# EAGLE design sbb-shield (EAGLE 9.4.1)

## Sheet 1 of 3
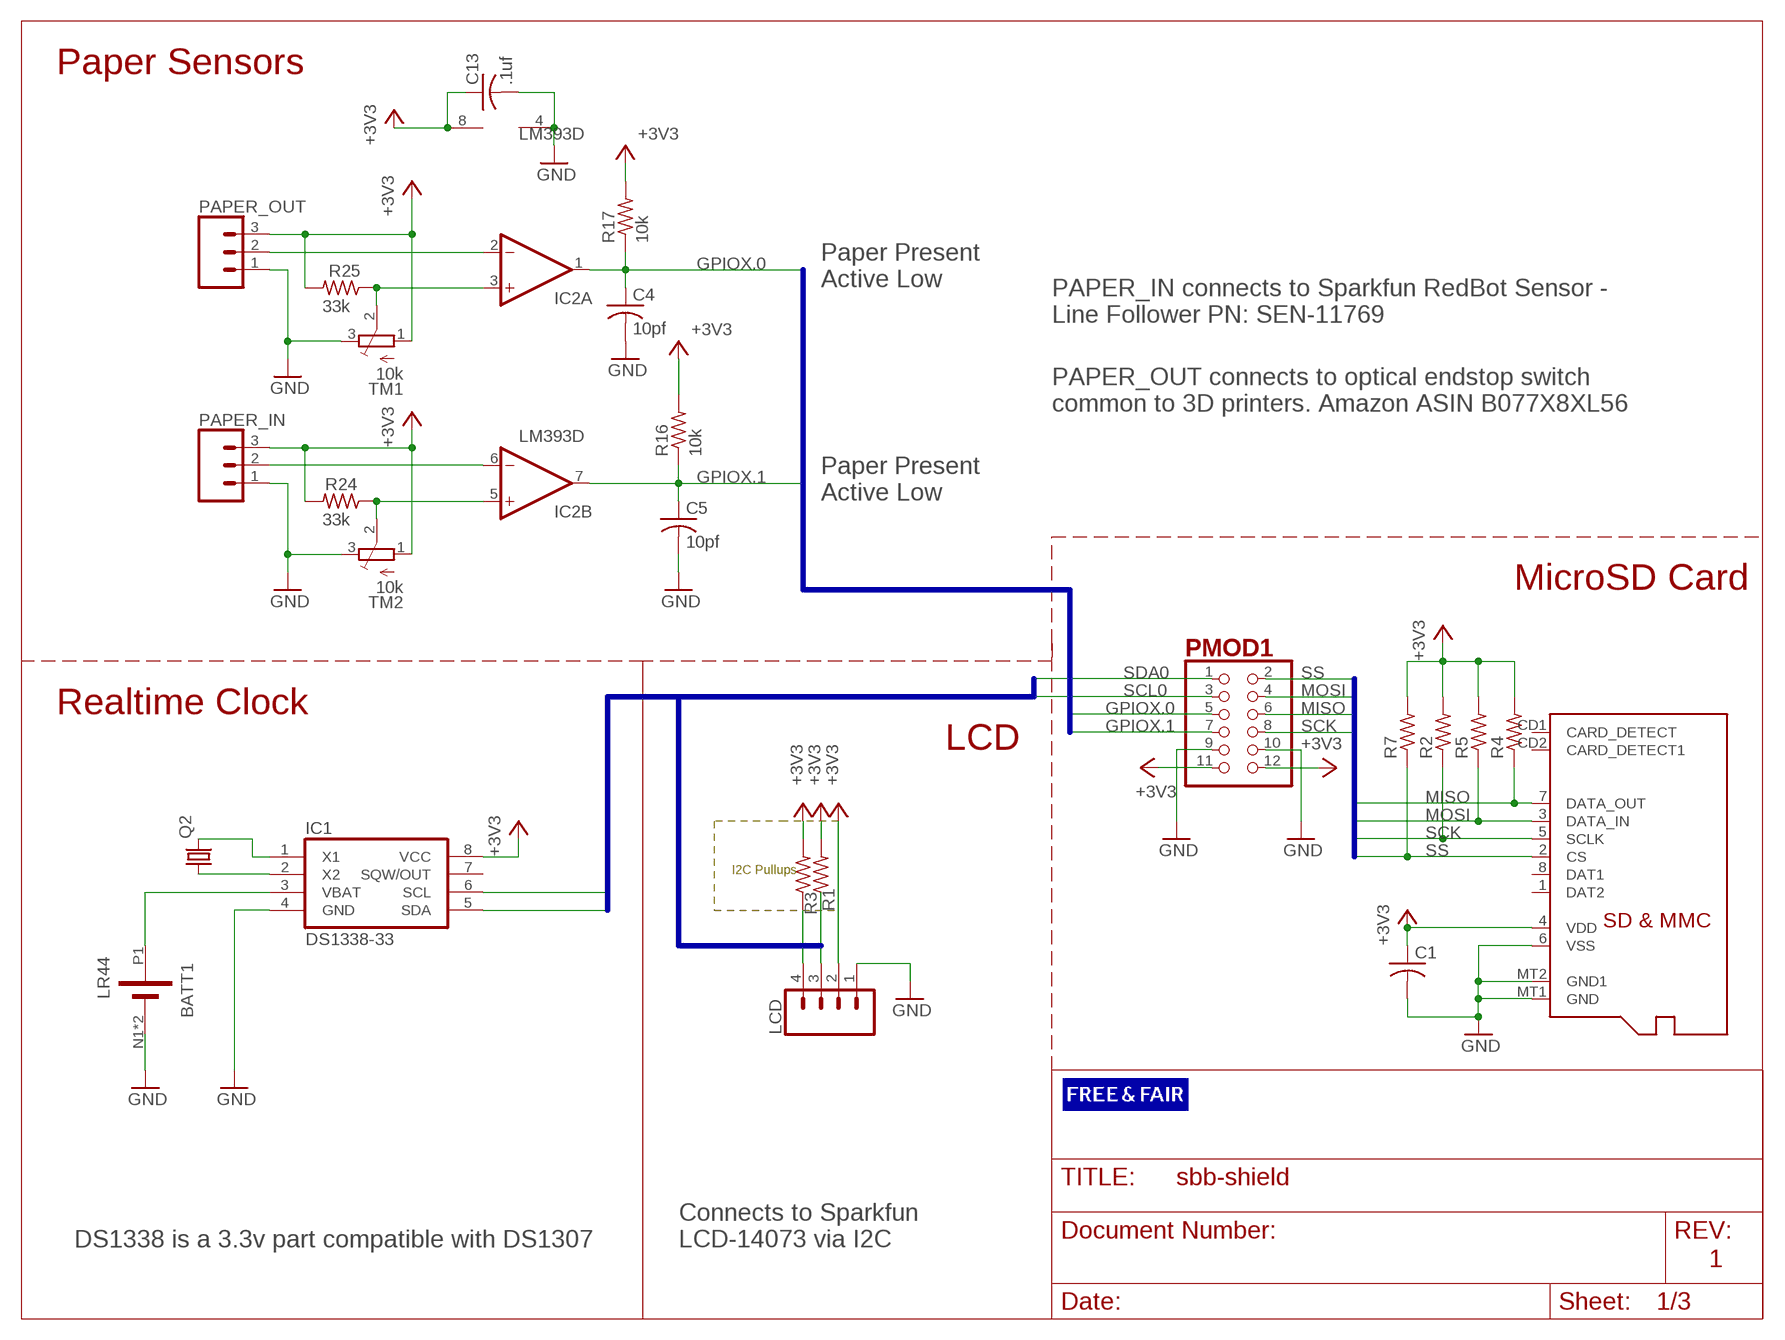
[diagram p0: schematic, sheet 1]

### Parts
BATT1  LR44  [LR44]
C1  C-USC0603K  [C0603K]
C4  10pf  C-USC0603K  [C0603K]
C5  10pf  C-USC0603K  [C0603K]
C13  .1uf  C-USC0603K  [C0603K]
IC1  DS1338-33  IC_RTC_DS1307  [SO-8]
IC2  LM393D  [SO08]
LCD  CONN_04POLAR_LOCK  [MOLEX-1X4_LOCK]
PAPER_IN  CONN_03POLAR_LOCK  [MOLEX-1X3_LOCK]
PAPER_OUT  CONN_03POLAR_LOCK  [MOLEX-1X3_LOCK]
PMOD1  PINHD-2X6  [2X06]
Q2  CRYSTALTC26H  [TC26H]
R1  R-US_R0603  [R0603]
R2  R-US_R0603  [R0603]
R3  R-US_R0603  [R0603]
R4  R-US_R0603  [R0603]
R5  R-US_R0603  [R0603]
R7  R-US_R0603  [R0603]
R16  10k  R-US_R0603  [R0603]
R17  10k  R-US_R0603  [R0603]
R24  33k  R-US_R0603  [R0603]
R25  33k  R-US_R0603  [R0603]
TM1  10k  TRIMPOTTC33X  [TC33X]
TM2  10k  TRIMPOTTC33X  [TC33X]
U1  MICROSD  [MICROSD]

### Nets
+3V3: C1.1 C13.1 IC1.8(VCC) IC2.8(P:V+) LCD.2 PAPER_IN.3 PAPER_OUT.3 PMOD1.11 PMOD1.12 R1.2 R2.2 R3.2 R4.2 R5.2 R7.2 R16.2 R17.2 R24.2 R25.2 TM1.1(A) TM2.1(A) U1.4(VDD) ; also sheet 2,3
GND: BATT1.N1(NEG) BATT1.N2(NEG) C1.2 C4.2 C5.2 C13.2 IC1.4(GND) IC2.4(P:V-) LCD.1 PAPER_IN.1 PAPER_OUT.1 PMOD1.9 PMOD1.10 TM1.3(E) TM2.3(E) U1.6(VSS) U1.MT1(GND) U1.MT2(GND1) ; also sheet 2,3
GPIOX.0: C4.1 IC2.1(A:OUT) PMOD1.5 R17.1 ; also sheet 3
GPIOX.1: C5.1 IC2.7(B:OUT) PMOD1.7 R16.1 ; also sheet 3
MISO: PMOD1.6 R4.1 U1.7(DATA_OUT) ; also sheet 3
MOSI: PMOD1.4 R5.1 U1.3(DATA_IN) ; also sheet 3
N$1: IC2.5(B:+IN) R24.1 TM2.2(S)
N$2: IC2.3(A:+IN) R25.1 TM1.2(S)
N$3: IC1.1(X1) Q2.2
N$8: IC1.2(X2) Q2.1
N$9: BATT1.P1(POS) IC1.3(VBAT)
N$13: IC2.2(A:-IN) PAPER_OUT.2
N$15: IC2.6(B:-IN) PAPER_IN.2
SCK: PMOD1.8 R2.1 U1.5(SCLK) ; also sheet 3
SCL0: IC1.6(SCL) LCD.4 PMOD1.3 R3.1 ; also sheet 3
SDA0: IC1.5(SDA) LCD.3 PMOD1.1 R1.1 ; also sheet 3
SS: PMOD1.2 R7.1 U1.2(CS) ; also sheet 3
Unconnected: IC1.7(SQW/OUT) U1.1(DAT2) U1.8(DAT1) U1.CD1(CARD_DETECT) U1.CD2(CARD_DETECT1)

### Buses
MISO,MOSI,SCK,SS
I2C:SCL0,SDA0
GPIOX.0,GPIOX.1

### Notes on the sheet
- Paper Sensors
- Paper Present
  Active Low
- PAPER_IN connects to Sparkfun RedBot Sensor - 
  Line Follower PN: SEN-11769
- PAPER_OUT connects to optical endstop switch 
  common to 3D printers. Amazon ASIN B077X8XL56
- Paper Present
  Active Low
- MicroSD Card
- Realtime Clock
- LCD
- I2C Pullups
- DS1338 is a 3.3v part compatible with DS1307
- Connects to Sparkfun
  LCD-14073 via I2C
- 1

## Sheet 2 of 3
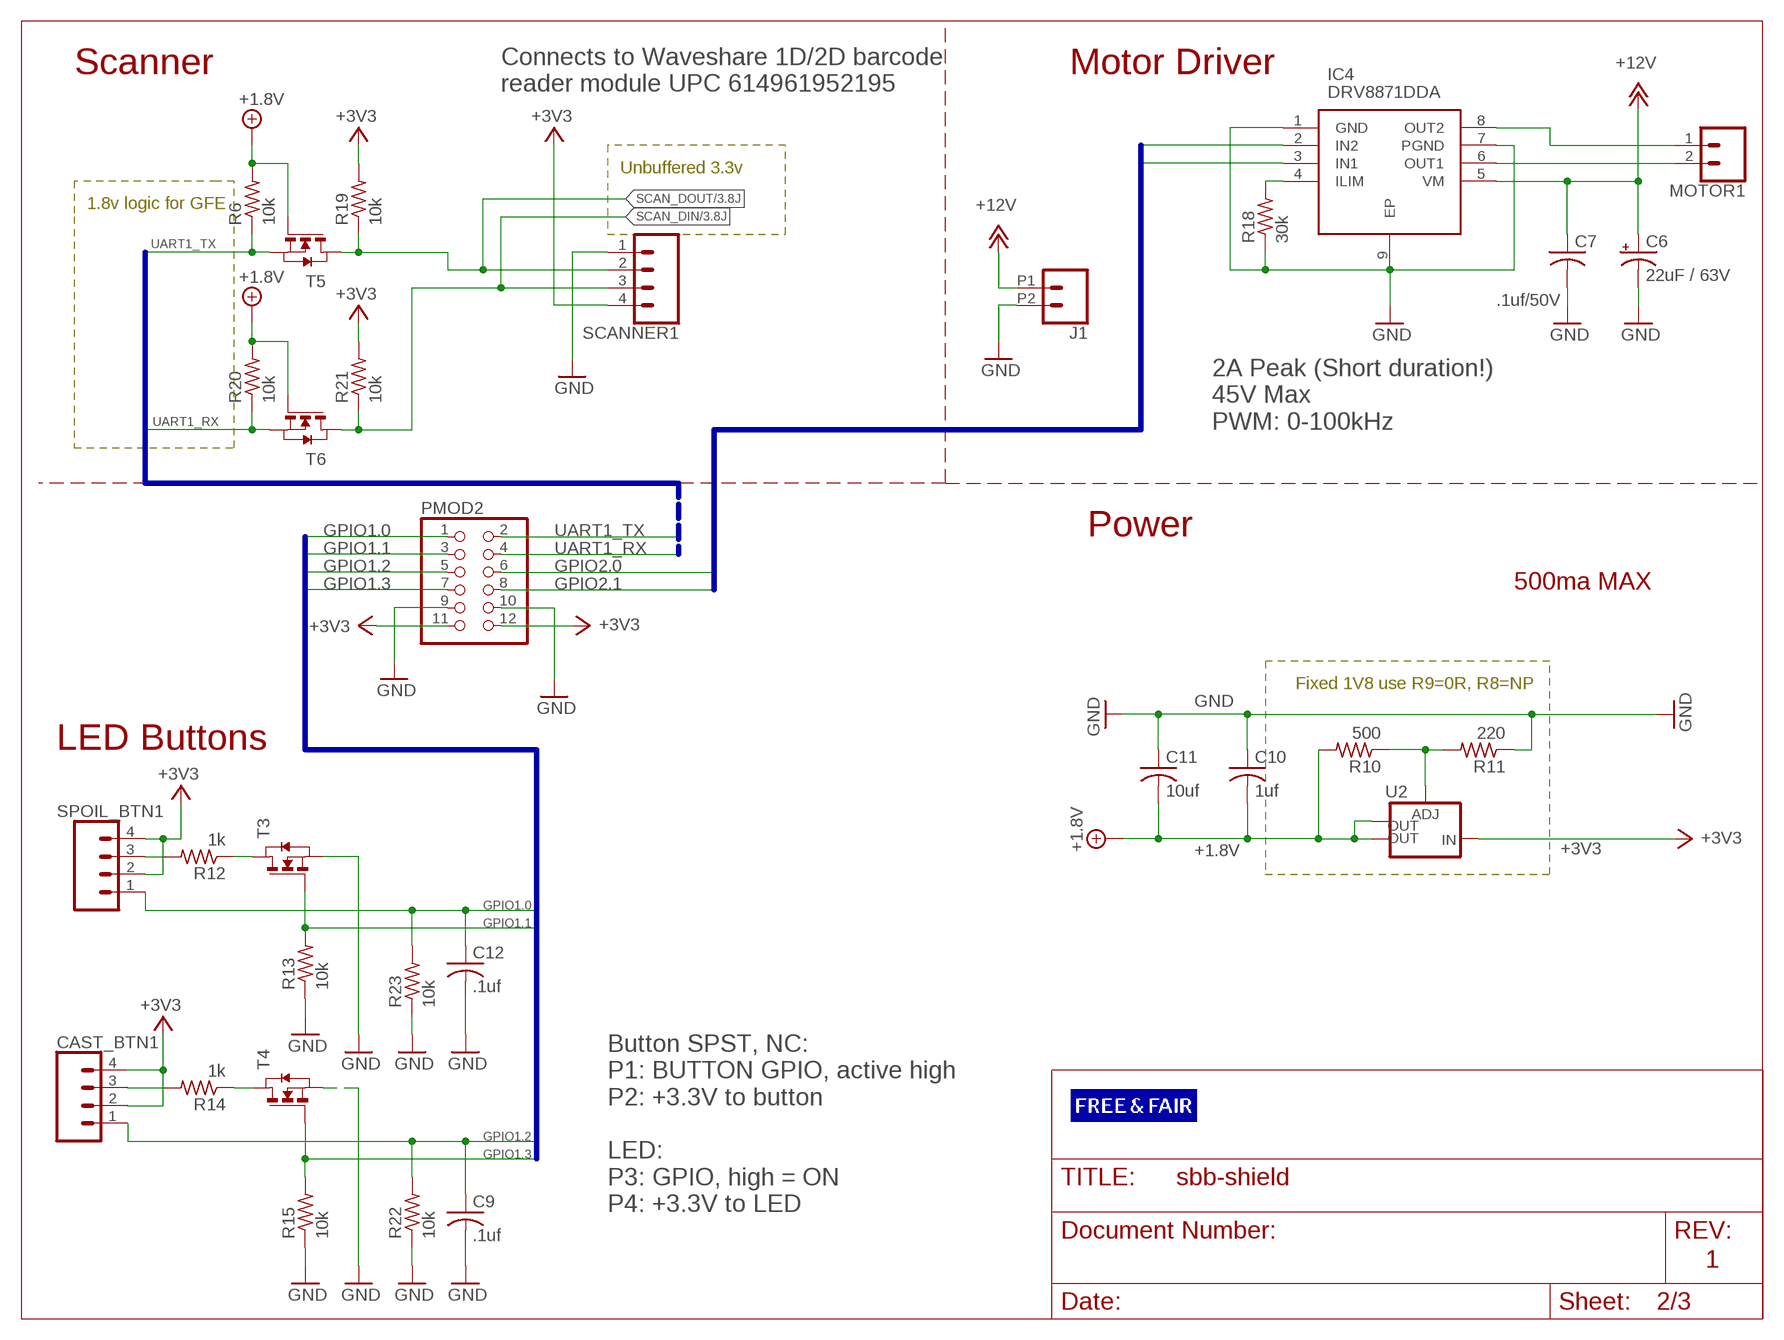
[diagram p1: schematic, sheet 2]

### Parts
C6  22uF / 63V  CPOL-USD  [PANASONIC_D]
C7  .1uf/50V  C-USC0805K  [C0805K]
C9  .1uf  C-USC0603K  [C0603K]
C10  1uf  C-USC0603K  [C0603K]
C11  10uf  C-USC1206K  [C1206K]
C12  .1uf  C-USC0603K  [C0603K]
CAST_BTN1  CONN_04POLAR_LOCK  [MOLEX-1X4_LOCK]
IC4  DRV8871DDA  [SOIC127P600X170-9N]
J1  CONN_022.54MM_SCREWTERM  [1X02_2.54_SCREWTERM]
MOTOR1  CONN_02POLAR_LOCK  [MOLEX-1X2_LOCK]
PMOD2  PINHD-2X6  [2X06]
R6  10k  R-US_R0603  [R0603]
R10  500  R-US_R0603  [R0603]
R11  220  R-US_R0603  [R0603]
R12  1k  R-US_R0603  [R0603]
R13  10k  R-US_R0603  [R0603]
R14  1k  R-US_R0603  [R0603]
R15  10k  R-US_R0603  [R0603]
R18  30k  R-US_R0603  [R0603]
R19  10k  R-US_R0603  [R0603]
R20  10k  R-US_R0603  [R0603]
R21  10k  R-US_R0603  [R0603]
R22  10k  R-US_R0603  [R0603]
R23  10k  R-US_R0603  [R0603]
SCANNER1  CONN_04POLAR_LOCK  [MOLEX-1X4_LOCK]
SPOIL_BTN1  CONN_04POLAR_LOCK  [MOLEX-1X4_LOCK]
T3  NMOSSOT23  [SOT-23]
T4  NMOSSOT23  [SOT-23]
T5  NMOSSOT23  [SOT-23]
T6  NMOSSOT23  [SOT-23]
U2  V_REG_LM1117SOT223  [SOT223]

### Nets
+1.8V: C10.2 C11.2 R6.2 R10.2 R20.2 T5.3(G) T6.3(G) U2.2(OUT) U2.4(OUT)
+3V3: CAST_BTN1.2 CAST_BTN1.4 PMOD2.11 PMOD2.12 R19.2 R21.2 SCANNER1.4 SPOIL_BTN1.2 SPOIL_BTN1.4 U2.3(IN) ; also sheet 1,3
+12V: C6.+ C7.1 IC4.5(VM) J1.P1
GND: C6.- C7.2 C9.2 C10.1 C11.1 C12.2 IC4.1(GND) IC4.7(PGND) IC4.9(EP) J1.P2 PMOD2.9 PMOD2.10 R11.1 R13.1 R15.1 R18.1 R22.1 R23.1 SCANNER1.1 T3.2(S) T4.2(S) ; also sheet 1,3
GPIO1.0: C12.1 PMOD2.1 R23.2 SPOIL_BTN1.1 ; also sheet 3
GPIO1.1: PMOD2.3 R13.2 T3.3(G) ; also sheet 3
GPIO1.2: C9.1 CAST_BTN1.1 PMOD2.5 R22.2 ; also sheet 3
GPIO1.3: PMOD2.7 R15.2 T4.3(G) ; also sheet 3
GPIO2.0: IC4.2(IN2) PMOD2.6 ; also sheet 3
GPIO2.1: IC4.3(IN1) PMOD2.8 ; also sheet 3
N$10: R12.1 T3.1(D)
N$12: R10.1 R11.2 U2.1(ADJ)
N$14: R12.2 SPOIL_BTN1.3
N$22: IC4.8(OUT2) MOTOR1.1
N$26: R14.1 T4.1(D)
N$28: IC4.6(OUT1) MOTOR1.2
N$29: IC4.4(ILIM) R18.2
N$30: CAST_BTN1.3 R14.2
SCAN_DIN: R21.1 SCANNER1.3 T6.1(D) ; also sheet 3
SCAN_DOUT: R19.1 SCANNER1.2 T5.1(D) ; also sheet 3
UART1_RX: PMOD2.4 R20.1 T6.2(S)
UART1_TX: PMOD2.2 R6.1 T5.2(S)

### Buses
UART1_RX,UART1_TX
GPIO2.0,GPIO2.1
GPIO1.0,UART1_TX,GND,GPIO2.0,UART1_RX,GPIO2.1,GPIO1.1,GPIO1.2,GPIO1.3

### Notes on the sheet
- Scanner | Motor Driver
- Connects to Waveshare 1D/2D barcode
  reader module UPC 614961952195
- Unbuffered 3.3v
- 1.8v logic for GFE
- 2A Peak (Short duration!)
  45V Max
  PWM: 0-100kHz
- Power
- 500ma MAX
- Fixed 1V8 use R9=0R, R8=NP
- LED Buttons
- Button SPST, NC:
  P1: BUTTON GPIO, active high
  P2: +3.3V to button 
  
  LED:
  P3: GPIO, high = ON
  P4: +3.3V to LED
- 1

## Sheet 3 of 3
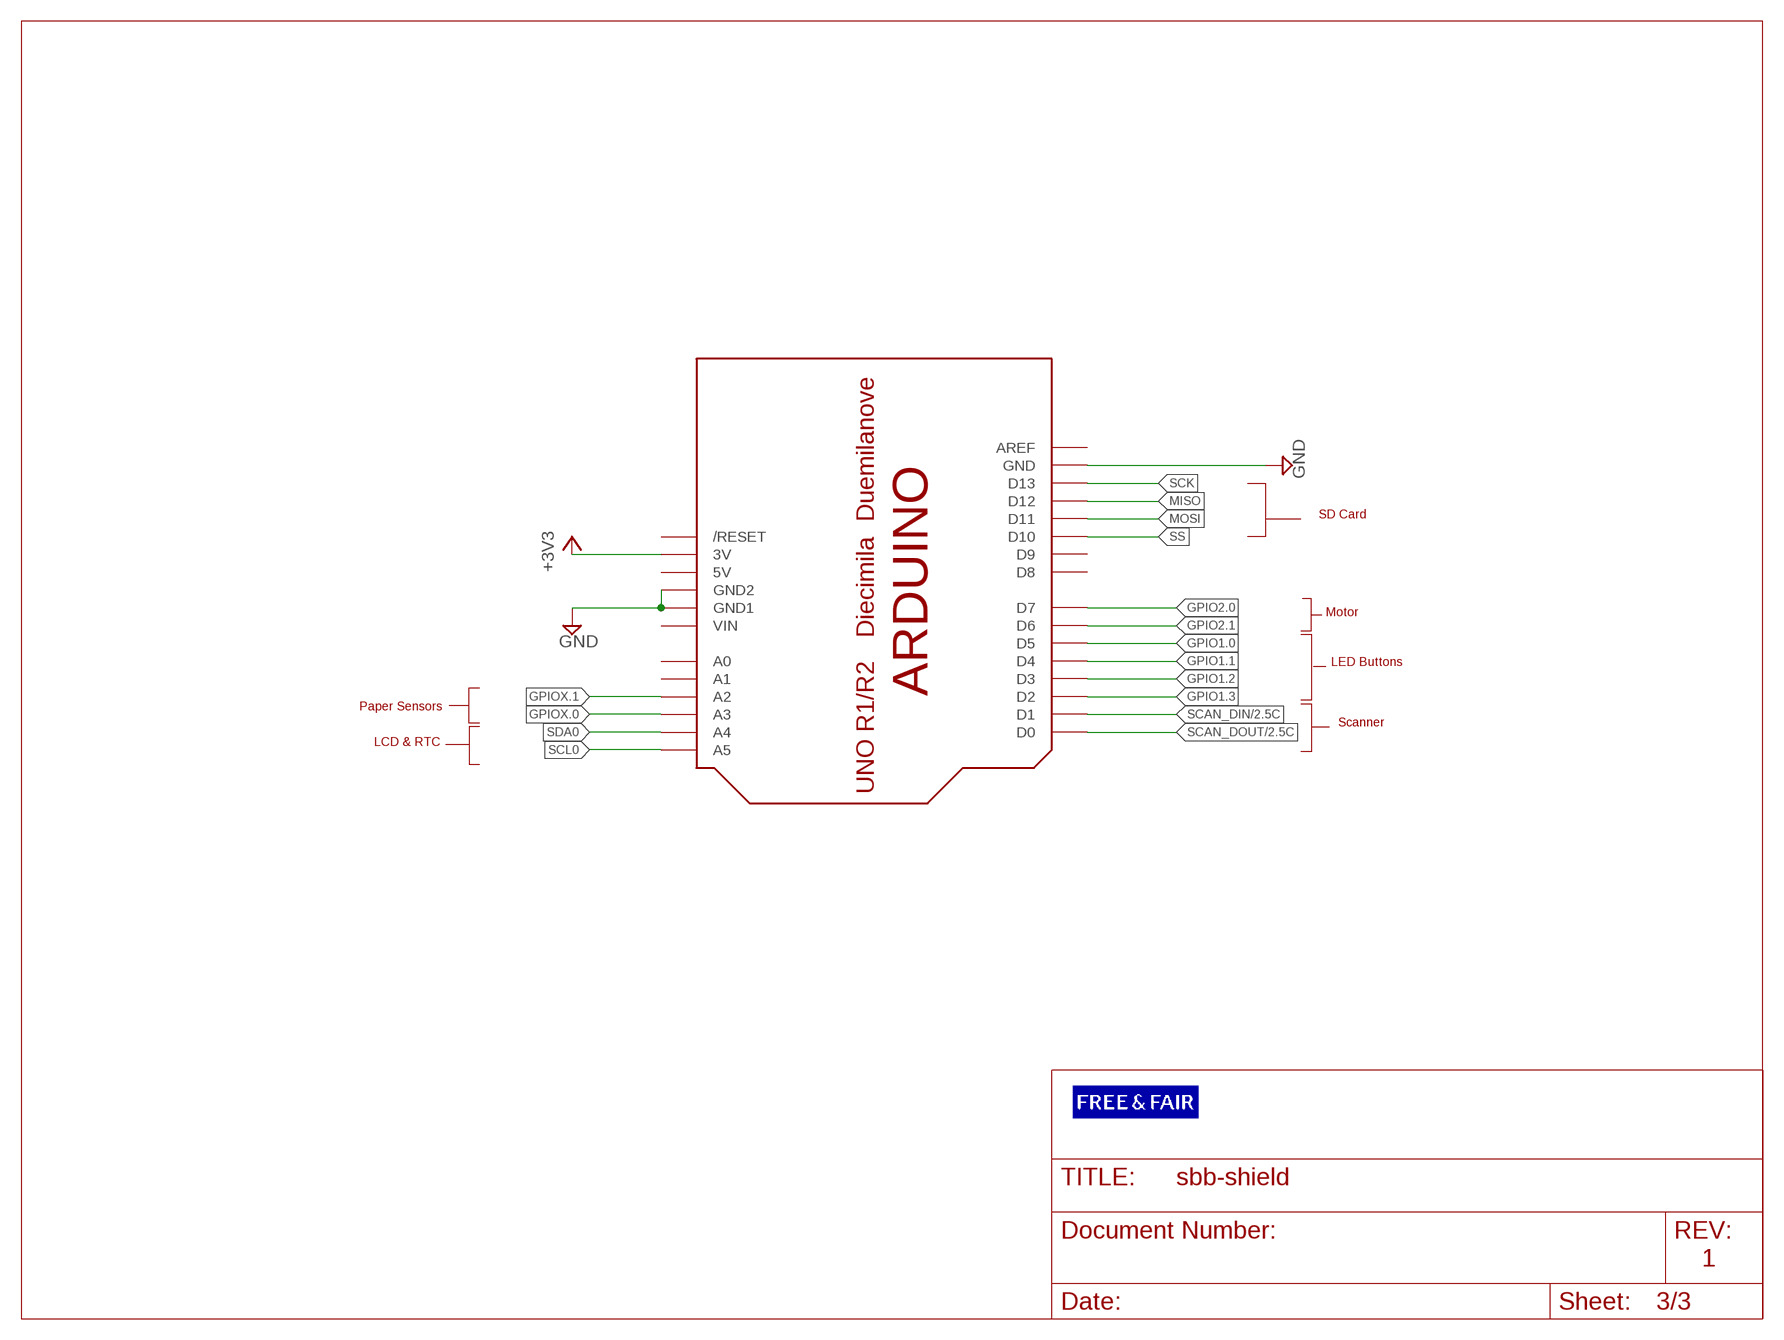
[diagram p2: schematic, sheet 3]

### Parts
U$2  ARDUINO-NOHOLE  [ARDUINO-NOHOLE]

### Nets
+3V3: U$2.3V ; also sheet 1,2
GND: U$2.GND U$2.GND1 U$2.GND2 ; also sheet 1,2
GPIO1.0: U$2.D5 ; also sheet 2
GPIO1.1: U$2.D4 ; also sheet 2
GPIO1.2: U$2.D3 ; also sheet 2
GPIO1.3: U$2.D2 ; also sheet 2
GPIO2.0: U$2.D7 ; also sheet 2
GPIO2.1: U$2.D6 ; also sheet 2
GPIOX.0: U$2.A3 ; also sheet 1
GPIOX.1: U$2.A2 ; also sheet 1
MISO: U$2.D12 ; also sheet 1
MOSI: U$2.D11 ; also sheet 1
SCAN_DIN: U$2.D1 ; also sheet 2
SCAN_DOUT: U$2.D0 ; also sheet 2
SCK: U$2.D13 ; also sheet 1
SCL0: U$2.A5 ; also sheet 1
SDA0: U$2.A4 ; also sheet 1
SS: U$2.D10 ; also sheet 1
Unconnected: U$2.A0 U$2.A1 U$2.AREF U$2.D8 U$2.D9 U$2.RESET(/RESET)

### Notes on the sheet
- SD Card
- Motor
- LED Buttons
- Paper Sensors
- Scanner
- LCD & RTC
- 1

## Power pins joined to a net without a drawn wire
5V: U$2.5V
VIN: U$2.VIN

## Library data of the parts
BATT1 = bitsetters:LR44
C1 C4 C5 C7 C13 = adafruit:C-US: CAPACITOR, American symbol
C6 = adafruit:CPOL-US: POLARIZED CAPACITOR, American symbol
C9 C10 C12 = rcl:C-US: CAPACITOR, American symbol; SPICEPREFIX: C
C11 = resistor:C-US: CAPACITOR, American symbol
CAST_BTN1 LCD SCANNER1 SPOIL_BTN1 = SparkFun-Connectors:CONN_04: Multi connection point. Often used as Generic Header-pin footprint for 0.1 inch spaced/style header connections On any of the 0.1 inch spaced packages, you can populate with these: Break Away Headers - Straight <https://www.sparkfun.com/products/116> (PRT-00116) Break Away Male Headers - Right Angle <https://www.sparkfun.com/products/553> (PRT-00553) Female Headers <https://www.sparkfun.com/products/115> (PRT-00115) Break Away Headers - Machine Pin <https://www.sparkfun.com/products/117> (PRT-00117) Break Away Female Headers - Swiss Machine Pin <https://www.sparkfun.com/products/743> (PRT-00743) For SCREWTERMINALS and SPRING TERMINALS visit here: Screw Terimnals on SparkFun.com <https://www.sparkfun.com/search/results?term=Screw+Terminals> (5mm/3.5mm/2.54mm spacing) This device is also useful as a general connection point to wire up your design to another part of your project. Our various solder wires solder well into these plated through hole pads. Hook-Up Wire - Assortment (Stranded, 22 AWG) <https://www.sparkfun.com/products/11375> (PRT-11375) Hook-Up Wire - Assortment (Solid Core, 22 AWG) <https://www.sparkfun.com/products/11367> (PRT-11367) View the entire wire category on our website here <https://www.sparkfun.com/categories/141> Special notes: Molex polarized connector foot print use with SKU : PRT-08231 with associated crimp pins and housings. 1MM SMD Version SKU: PRT-10208; PROD_ID: CONN-08186; SF_ID: PRT-08231
IC1 = dp_devices:IC_RTC_DS1307
IC2 = linear:LM393: COMPARATOR
IC4 = SamacSys_Parts:DRV8871DDA: Motor / Motion / Ignition Controllers & Drivers 3.6A Brushed DC Motor Driver with Integrated Current Sensing (PWM Ctrl) 8-SO PowerPAD -40 to 125 Source: Datasheet <http://www.ti.com/lit/ds/symlink/drv8871.pdf>; DESCRIPTION: Motor / Motion / Ignition Controllers & Drivers 3.6A Brushed DC Motor Driver with Integrated Current Sensing (PWM Ctrl) 8-SO PowerPAD -40 to 125; HEIGHT: 1.7mm; MANUFACTURER_NAME: Texas Instruments; MANUFACTURER_PART_NUMBER: DRV8871DDA; MOUSER_PART_NUMBER: 595-DRV8871DDA; MOUSER_PRICE-STOCK: https://www.mouser.com/Search/Refine.aspx?Keyword=595-DRV8871DDA
J1 = SparkFun-Connectors:CONN_02: Multi connection point. Often used as Generic Header-pin footprint for 0.1 inch spaced/style header connections On any of the 0.1 inch spaced packages, you can populate with these: Break Away Headers - Straight <https://www.sparkfun.com/products/116> (PRT-00116) Break Away Male Headers - Right Angle <https://www.sparkfun.com/products/553> (PRT-00553) Female Headers <https://www.sparkfun.com/products/115> (PRT-00115) Break Away Headers - Machine Pin <https://www.sparkfun.com/products/117> (PRT-00117) Break Away Female Headers - Swiss Machine Pin <https://www.sparkfun.com/products/743> (PRT-00743) For SCREWTERMINALS and SPRING TERMINALS visit here: Screw Terimnals on SparkFun.com <https://www.sparkfun.com/search/results?term=Screw+Terminals> (5mm/3.5mm/2.54mm spacing) This device is also useful as a general connection point to wire up your design to another part of your project. Our various solder wires solder well into these plated through hole pads. Hook-Up Wire - Assortment (Stranded, 22 AWG) <https://www.sparkfun.com/products/11375> (PRT-11375) Hook-Up Wire - Assortment (Solid Core, 22 AWG) <https://www.sparkfun.com/products/11367> (PRT-11367) View the entire wire category on our website here <https://www.sparkfun.com/categories/141> Special notes: Molex polarized connector foot print use with: PRT-08233 with associated crimp pins and housings. 2.54_SCREWTERM for use with PRT-10571. 3.5mm Screw Terminal footprints for PRT-08084 5mm Screw Terminal footprints for use with PRT-08432
MOTOR1 = SparkFun-Connectors:CONN_02: Multi connection point. Often used as Generic Header-pin footprint for 0.1 inch spaced/style header connections On any of the 0.1 inch spaced packages, you can populate with these: Break Away Headers - Straight <https://www.sparkfun.com/products/116> (PRT-00116) Break Away Male Headers - Right Angle <https://www.sparkfun.com/products/553> (PRT-00553) Female Headers <https://www.sparkfun.com/products/115> (PRT-00115) Break Away Headers - Machine Pin <https://www.sparkfun.com/products/117> (PRT-00117) Break Away Female Headers - Swiss Machine Pin <https://www.sparkfun.com/products/743> (PRT-00743) For SCREWTERMINALS and SPRING TERMINALS visit here: Screw Terimnals on SparkFun.com <https://www.sparkfun.com/search/results?term=Screw+Terminals> (5mm/3.5mm/2.54mm spacing) This device is also useful as a general connection point to wire up your design to another part of your project. Our various solder wires solder well into these plated through hole pads. Hook-Up Wire - Assortment (Stranded, 22 AWG) <https://www.sparkfun.com/products/11375> (PRT-11375) Hook-Up Wire - Assortment (Solid Core, 22 AWG) <https://www.sparkfun.com/products/11367> (PRT-11367) View the entire wire category on our website here <https://www.sparkfun.com/categories/141> Special notes: Molex polarized connector foot print use with: PRT-08233 with associated crimp pins and housings. 2.54_SCREWTERM for use with PRT-10571. 3.5mm Screw Terminal footprints for PRT-08084 5mm Screw Terminal footprints for use with PRT-08432; SF_ID: PRT-09918
PAPER_IN PAPER_OUT = SparkFun-Connectors:CONN_03: Multi connection point. Often used as Generic Header-pin footprint for 0.1 inch spaced/style header connections On any of the 0.1 inch spaced packages, you can populate with these: Break Away Headers - Straight <https://www.sparkfun.com/products/116> (PRT-00116) Break Away Male Headers - Right Angle <https://www.sparkfun.com/products/553> (PRT-00553) Female Headers <https://www.sparkfun.com/products/115> (PRT-00115) Break Away Headers - Machine Pin <https://www.sparkfun.com/products/117> (PRT-00117) Break Away Female Headers - Swiss Machine Pin <https://www.sparkfun.com/products/743> (PRT-00743) Stackable Header - 3 Pin (Female, 0.1") <https://www.sparkfun.com/products/13875> (PRT-13875) For SCREWTERMINALS and SPRING TERMINALS visit here: Screw Terimnals on SparkFun.com <https://www.sparkfun.com/search/results?term=Screw+Terminals> (5mm/3.5mm/2.54mm spacing) This device is also useful as a general connection point to wire up your design to another part of your project. Our various solder wires solder well into these plated through hole pads. Hook-Up Wire - Assortment (Stranded, 22 AWG) <https://www.sparkfun.com/products/11375> (PRT-11375) Hook-Up Wire - Assortment (Solid Core, 22 AWG) <https://www.sparkfun.com/products/11367> (PRT-11367) View the entire wire category on our website here <https://www.sparkfun.com/categories/141> Special notes: Molex polarized connector foot print use with SKU : PRT-08232 with associated crimp pins and housings.; PROD_ID: CONN-08625; SF_ID: PRT-08096
PMOD1 PMOD2 = pinhead:PINHD-2X6: PIN HEADER
Q2 = adafruit (DESKTOP-MKQ6VR9's conflicted copy 2019-02-08):CRYSTAL: CRYSTAL; OC_FARNELL: unknown; OC_NEWARK: unknown
R1-R7 R12-R25 = adafruit:R-US_: RESISTOR, American symbol
R10 R11 = resistor:R-US_: RESISTOR, American symbol
T3-T6 = zetex:NMOSSOT23: MOS FET; OC_FARNELL: unknown; OC_NEWARK: unknown
TM1 TM2 = adafruit:TRIMPOT: SMT trimmer potentiometer part number TC33X http://www.ladyada.net/library/eagle
U1 = adafruit:MICROSD: Micro-SD / Transflash card holder with SPI pinout For the 3M # 2908-05WB-MG and/or 4UCON #19656 push-push type
U2 = SparkFun-IC-Power:V_REG_LM1117: Voltage Regulator LM1117 Standard adjustable voltage regulator but in SMD form. Spark Fun Electronics SKU : COM-00595; PROD_ID: VREG-08170
U$2 = adafruit:ARDUINO: Arduino Diecimila/Duemilanove Make a shield with ease, this package has all the named pins as well as the two mounting drill holes and an outline of the USB and DC power connector. The outline is on the DIMENSION layer, so if your board house uses it they will cut the outline to match. http://www.ladyada.net/library/pcb/eaglelibrary.html

## Board
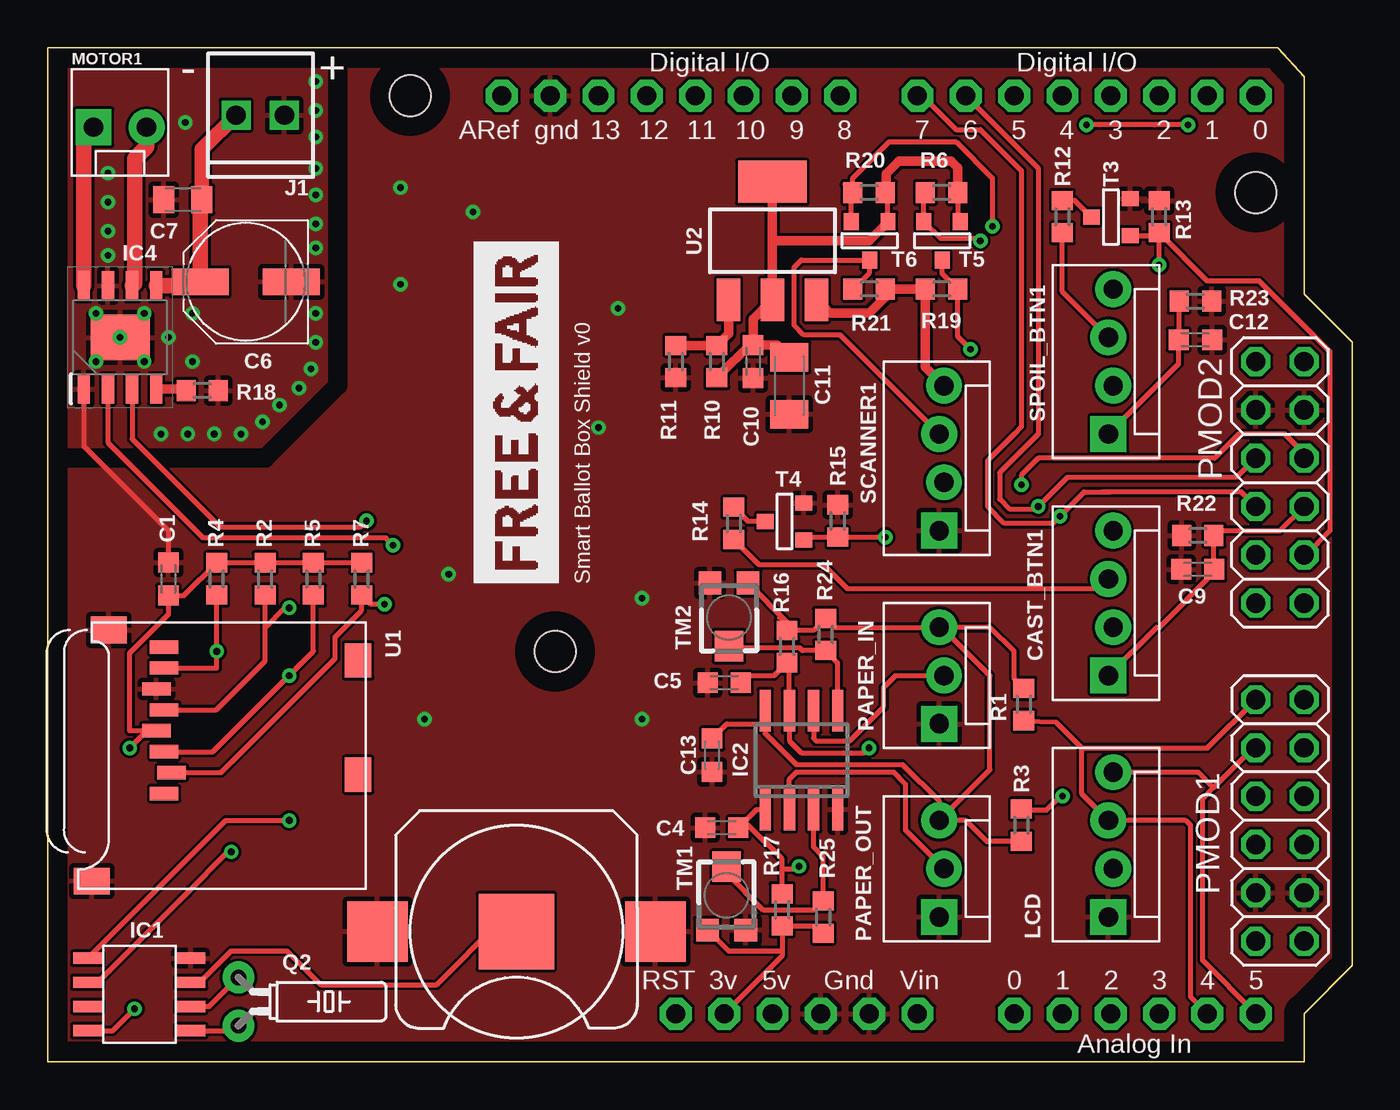
[diagram p3: board, top side]
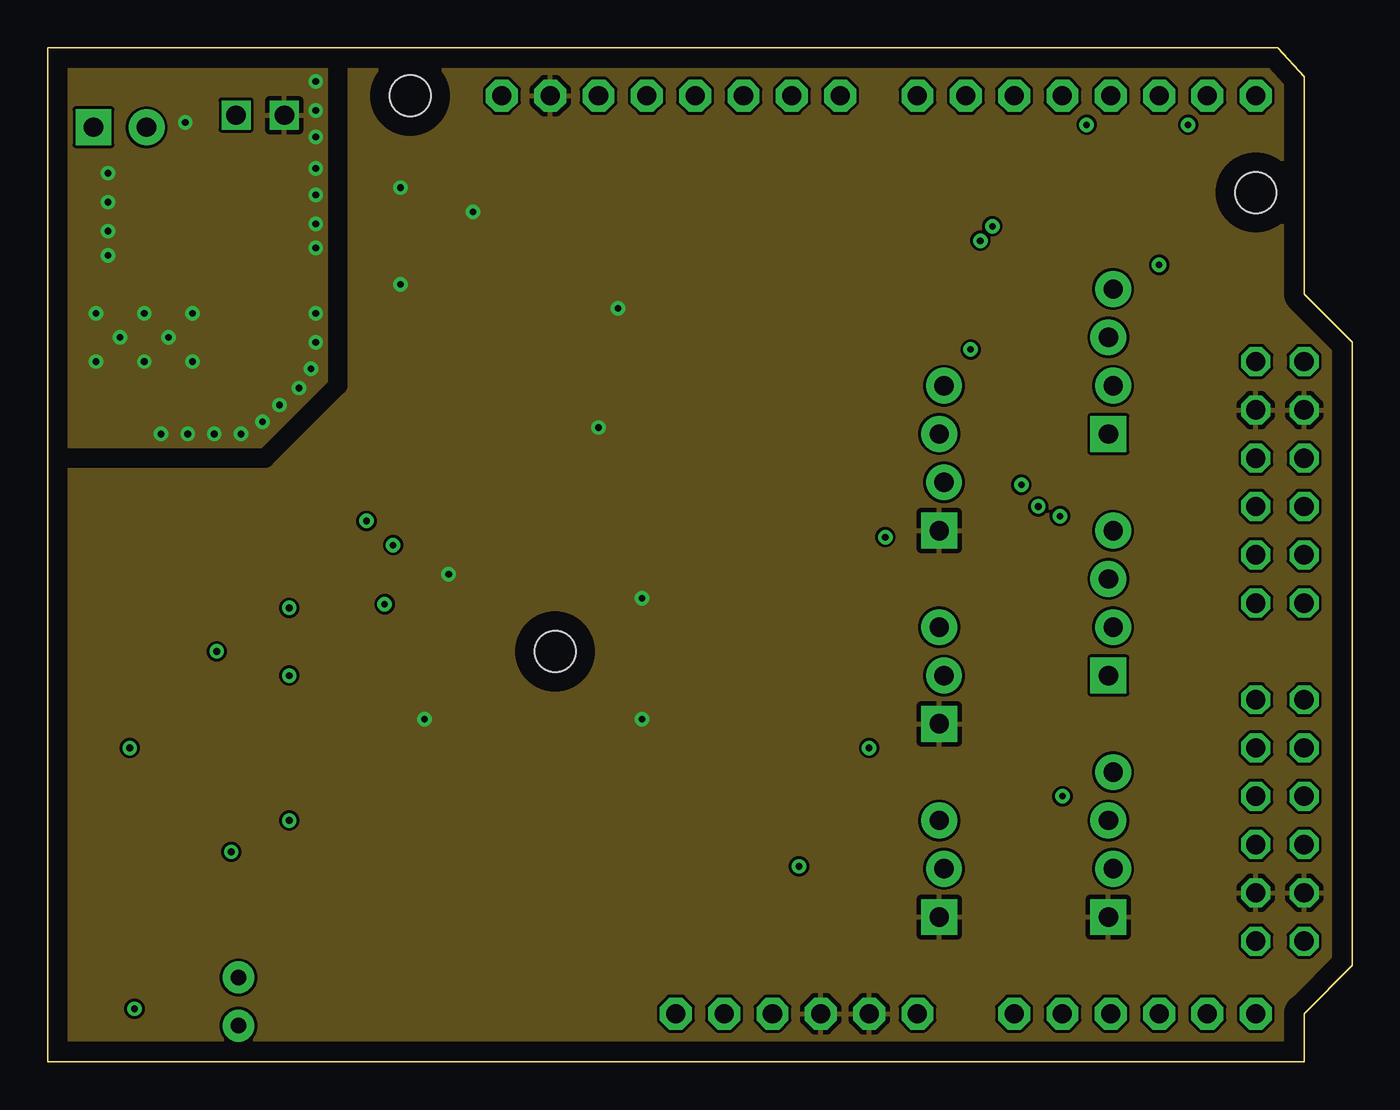
[diagram p4: board, inner layer Route2]
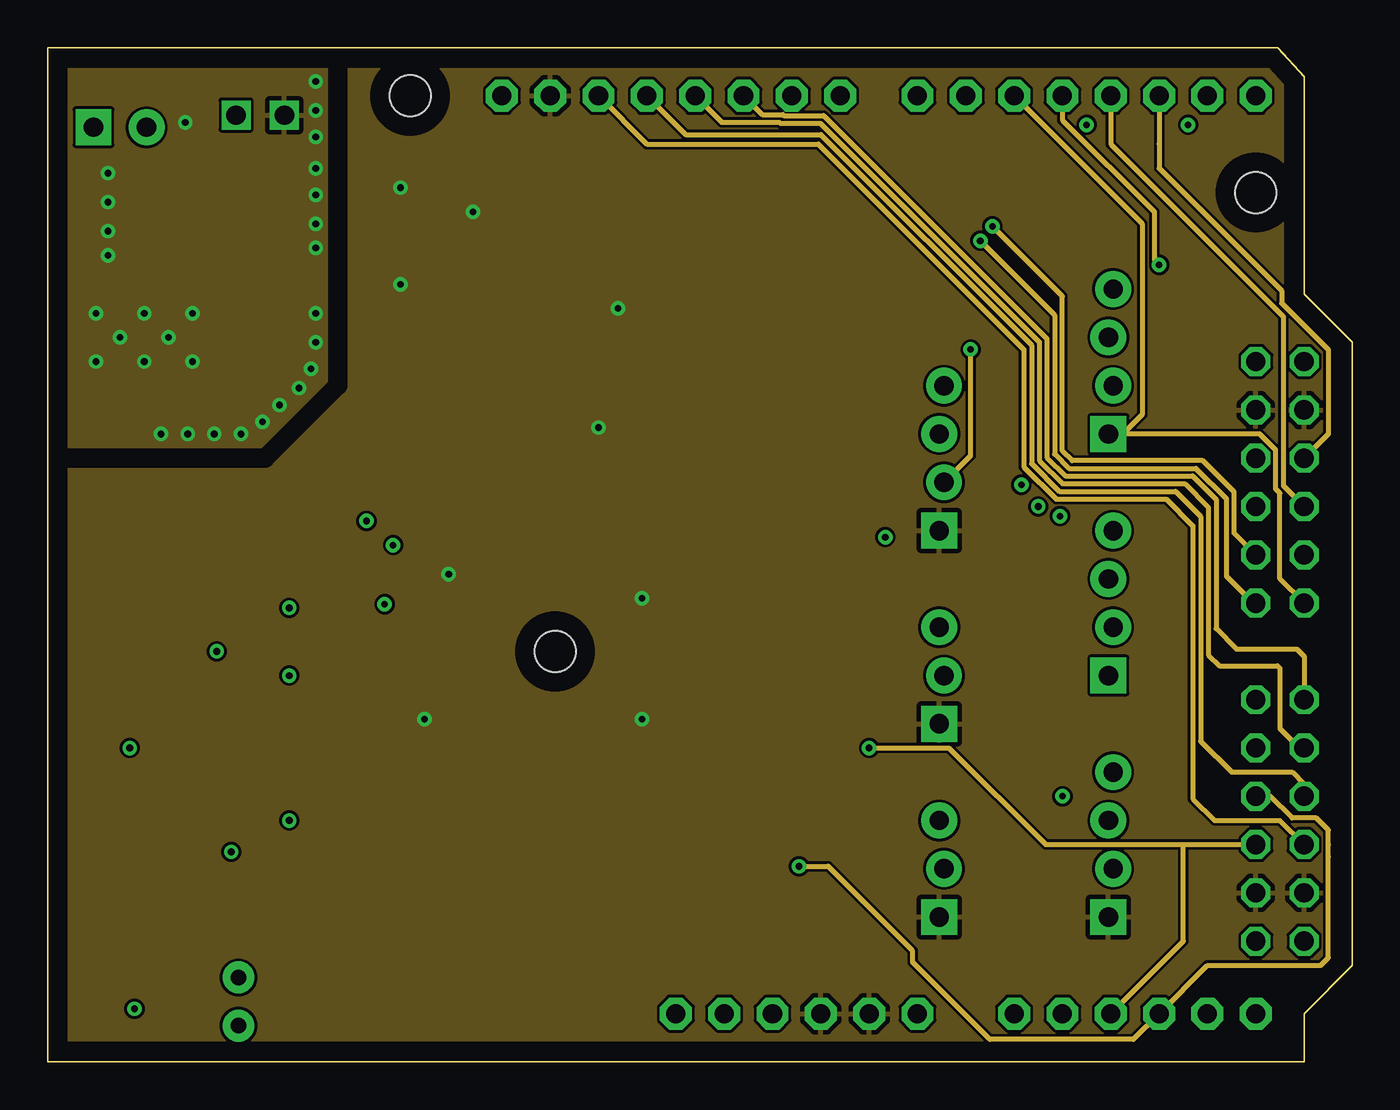
[diagram p5: board, inner layer Route15]
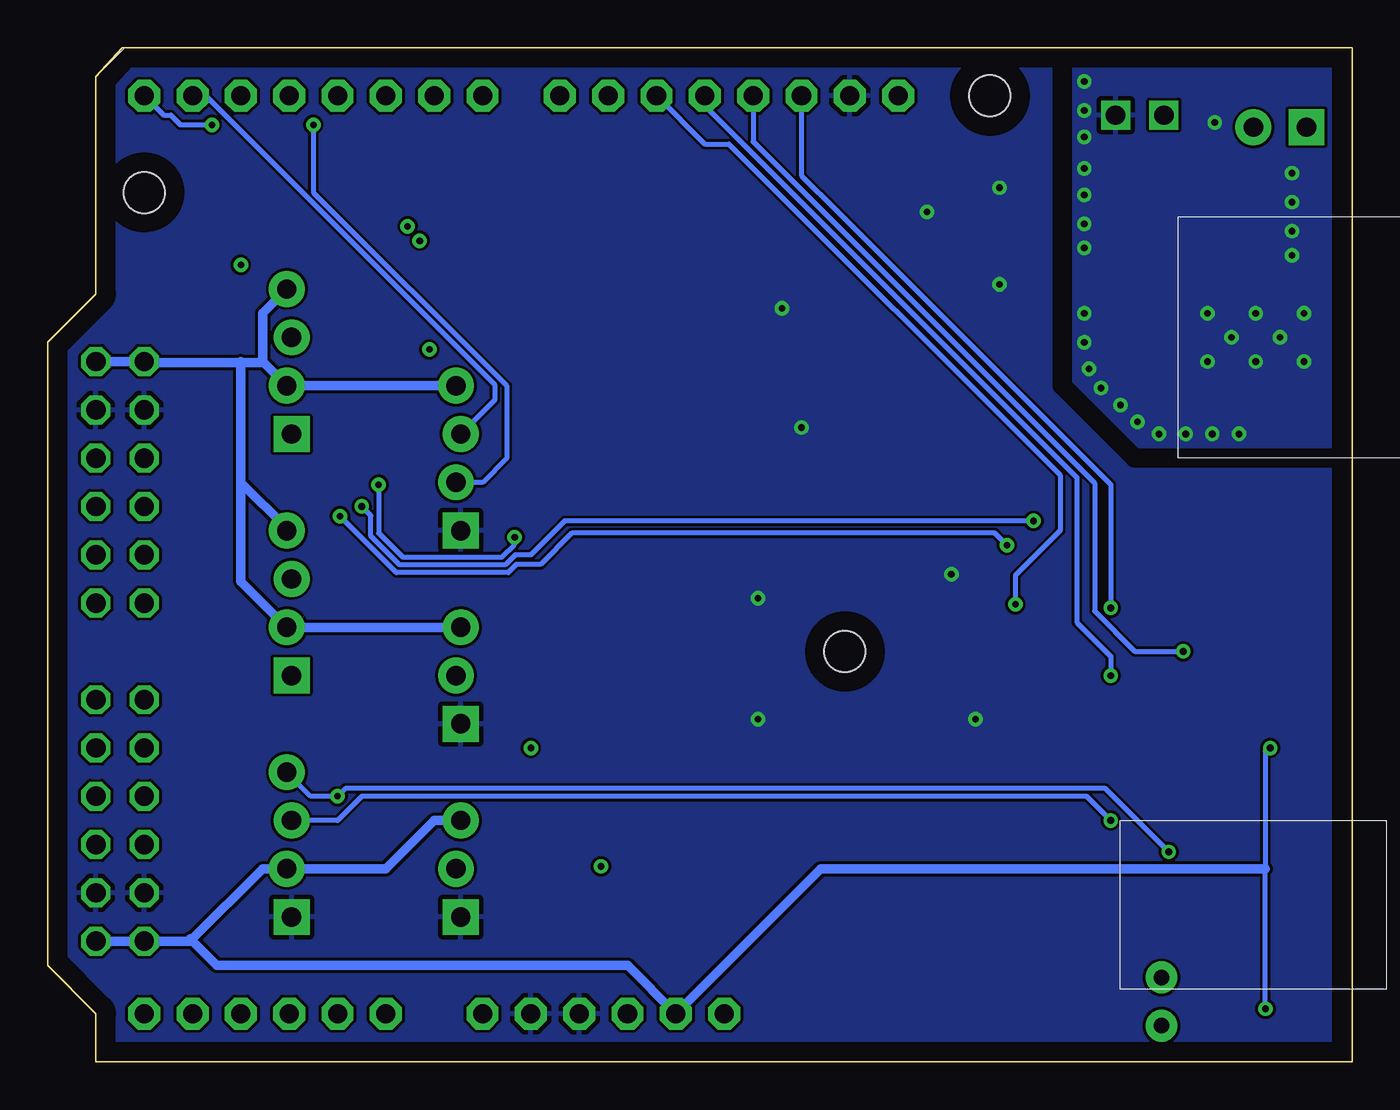
[diagram p6: board, bottom side, seen from below]

Size 68.58 x 53.34 mm. Coordinates in mm from the lower left corner, seen from the top.
Outline: 0,53.33 0,0
Outline: 0,0 66.04,0 66.04,2.54 68.58,5.08 68.58,37.85 66.04,40.39 66.04,51.82 64.64,53.34 0,53.34 0,0
Copper layers (1+2*15+16): Top 0.035mm / dielectric 0.15mm / Route2 0.035mm / dielectric 0.15mm / Route15 0.035mm / dielectric 0.2mm / Bottom 0.035mm
Design rules "default *": minimum track width 6mil, minimum drill 0.3mm, track to track 6mil, track to pad 6mil, pad to pad 6mil, via to via 6mil, smd to smd 6mil, copper to edge 40mil, drill to drill 6mil, minimum pad ring 10mil, minimum via ring 8mil, stop-mask expansion 4mil, vias tented up to drill 15mil, thermal gap 10mil
Holes 2.16 mm at 63.5,45.72 19.05,50.8 26.67,21.59
tKeepout: 3 lines
tRestrict: 3 lines
bRestrict: 3 lines

### Footprints (pad centres in the part's own frame; a part is rotated, then mirrored left to right if it is on the bottom)
LR44 = smd 3.175 x 3.175: N1 -7.303,0; N2 7.303,0 | smd 3.962 x 3.962: P1 0,0
C0603K = smd 1.05 x 1.08: 1 -0.875,0; 2 0.875,0
PANASONIC_D = smd 3 x 1.4: + 2.4,0; - -2.4,0
C0805K = smd 1.1 x 1.4: 1 -1,0; 2 1,0
C1206K = smd 1.5 x 2: 1 -1.5,0; 2 1.5,0
MOLEX-1X4_LOCK = drill 1.016 pad 1.88 square: 1 0,0.127 | drill 1.016 pad 1.88: 2 2.54,-0.127; 3 5.08,0.127; 4 7.62,-0.127
SO-8 = smd 0.6 x 1.55: 1 -1.905,-2.69; 2 -0.635,-2.69; 3 0.635,-2.69; 4 1.905,-2.69; 5 1.905,2.71; 6 0.635,2.71; 7 -0.635,2.71; 8 -1.905,2.71
SO08 = smd 0.6 x 2.2: 1 -1.905,-2.6; 2 -0.635,-2.6; 3 0.635,-2.6; 4 1.905,-2.6; 5 1.905,2.6; 6 0.635,2.6; 7 -0.635,2.6; 8 -1.905,2.6
SOIC127P600X170-9N = smd 1.525 x 0.65: 1 -2.712,1.905; 2 -2.712,0.635; 3 -2.712,-0.635; 4 -2.712,-1.905; 5 2.712,-1.905; 6 2.712,-0.635; 7 2.712,0.635; 8 2.712,1.905 | smd 2.4 x 3.1: 9 0,0
1X02_2.54_SCREWTERM = drill 1.016 square: P1 2.54,0; P2 0,0
MOLEX-1X2_LOCK = drill 1.016 pad 1.88 square: 1 -0.127,0 | drill 1.016 pad 1.88: 2 2.667,0
MOLEX-1X3_LOCK = drill 1.016 pad 1.88 square: 1 0,0.127 | drill 1.016 pad 1.88: 2 2.54,-0.127; 3 5.08,0.127
2X06 = drill 1.016 octagon: 1 -6.35,-1.27; 2 -6.35,1.27; 3 -3.81,-1.27; 4 -3.81,1.27; 5 -1.27,-1.27; 6 -1.27,1.27; 7 1.27,-1.27; 8 1.27,1.27; 9 3.81,-1.27; 10 3.81,1.27; 11 6.35,-1.27; 12 6.35,1.27
TC26H = drill 0.813 pad 1.676: 1 -1.27,0; 2 1.27,0
R0603 = smd 1 x 1.1: 1 -0.85,0; 2 0.85,0
SOT-23 = smd 0.787 x 0.889: 1 0.025,-1.016; 2 -0.94,1.016; 3 0.991,1.016
TC33X = smd 1.2 x 1.2: 1 -1,-1.825; 3 1,-1.825 | smd 1.5 x 1.6: 2 0,1.5
MICROSD = smd 0.7 x 1.5: 1 9,-10.64; 2 7.9,-10.24; 3 6.8,-10.64; 4 5.7,-11.04; 5 4.6,-10.64; 6 3.5,-11.04; 7 2.4,-10.64; 8 1.3,-10.64 | smd 1.8 x 1.4: CD1 2,-0.44; CD2 8,-0.44 | smd 1.4 x 1.9: MT1 0.4,-13.54; MT2 13.6,-14.44
SOT223 = smd 1.219 x 2.235: 1 -2.311,-3.099; 2 0,-3.099; 3 2.311,-3.099 | smd 3.6 x 2.2: 4 0,3.099
ARDUINO-NOHOLE = drill 1 pad 1.676 octagon: 3V 35.56,2.54; 5V 38.1,2.54; A0 50.8,2.54; A1 53.34,2.54; A2 55.88,2.54; A3 58.42,2.54; A4 60.96,2.54; A5 63.5,2.54; AREF 23.876,50.8; D0 63.5,50.8; D1 60.96,50.8; D2 58.42,50.8; D3 55.88,50.8; D4 53.34,50.8; D5 50.8,50.8; D6 48.26,50.8; D7 45.72,50.8; D8 41.656,50.8; D9 39.116,50.8; D10 36.576,50.8; D11 34.036,50.8; D12 31.496,50.8; D13 28.956,50.8; GND 26.416,50.8; GND1 43.18,2.54; GND2 40.64,2.54; RESET 33.02,2.54; VIN 45.72,2.54

### Placement (x,y rotation side)
BATT1  24.64,6.86 180 top
C1  6.35,25.4 90 top
C4  35.43,12.32 180 top
C5  35.56,19.94 180 top
C6  10.41,41.02 180 top
C7  7.11,45.34 180 top
C9  60.45,25.91 180 top
C10  37.08,36.83 90 top
C11  38.99,35.56 90 top
C12  60.33,37.97 0 top
C13  34.92,16.13 270 top
CAST_BTN1  55.88,20.32 90 top
IC1  4.83,3.56 90 top
IC2  39.62,15.88 0 top
IC4  3.81,38.1 90 top
J1  12.45,49.78 180 top
LCD  55.88,7.62 90 top
MOTOR1  2.54,49.15 0 top
PAPER_IN  46.99,17.78 90 top
PAPER_OUT  46.99,7.62 90 top
PMOD1  64.77,12.7 270 top
PMOD2  64.77,30.48 90 top
Q2  10.03,3.17 270 top
R1  51.31,18.8 90 top
R2  11.43,25.4 90 top
R3  51.18,12.45 270 top
R4  8.89,25.4 90 top
R5  13.97,25.4 90 top
R6  46.99,45.72 0 top
R7  16.51,25.4 90 top
R10  35.18,36.83 270 top
R11  33.02,36.83 90 top
R12  53.34,44.45 270 top
R13  58.42,44.45 270 top
R14  36.07,28.32 270 top
R15  41.53,28.45 270 top
R16  38.86,21.84 90 top
R17  38.61,8 270 top
R18  8.13,35.31 180 top
R19  46.99,40.64 180 top
R20  43.18,45.72 0 top
R21  43.18,40.64 0 top
R22  60.45,27.69 0 top
R23  60.33,40.01 180 top
R24  40.89,22.48 90 top
R25  40.77,7.62 270 top
SCANNER1  46.99,27.94 90 top
SPOIL_BTN1  55.88,33.02 90 top
T3  55.88,44.45 270 top
T4  38.73,28.45 270 top
T5  46.99,43.18 0 top
T6  43.18,43.18 0 top
TM1  35.69,8.76 0 top
TM2  35.81,23.37 180 top
U1  16.76,23.11 270 top
U2  38.1,43.18 0 top
U$2  0,0 0 top

### Tracks (layer width: path | path; a pad name or v marks a point on that pad's centre or on a via)
+1.8V
  Top 0.254: T5.3 47.84,44.34 R6.2 | T6.3 44.17,45.58 R20.2
  Top 0.508: R6.2 47.84,47.03 47.5,47.37 44.73,47.37 44.07,46.7 44.07,45.76 R20.2 | 38.1,43.18 U2.2 37.08,39.06 37.08,38.1 | 38.1,43.18 U2.4 | 37.08,38.1 C10.2 38.34,37.7 C11.2 | R10.2 37.08,37.88 37.08,38.1 | T6.3 44.17,44.17 43.18,43.18 38.1,43.18
+3V3  (via drill 0.35)
  Top 0.254: R7.2 R5.2 R2.2 R4.2 7.17,24.52 C1.1 6.35,23.54 4.32,21.5 4.32,17.41 U1.4 5.22,17.41 v4.32,16.51 | IC1.8 3.43,1.65 v4.57,2.79 | R3.2 49.36,11.6 48.26,12.7 PAPER_OUT.3 | R1.2 50.8,20.15 50.8,21.59 49.53,22.86 46.99,22.86 | 46.99,22.86 PAPER_IN.3 41.36,22.86 R24.2 40.26,22.69 R16.2 38.86,22.99 | TM2.1 38.86,23.14 38.86,22.99 | IC2.8 37.72,17.78 | 37.72,17.78 37.72,17.27 39.34,15.65 44.93,15.65 46.86,13.72 PAPER_OUT.3 | C13.1 35.7,17.78 37.72,17.78 | 38.48,23.37 38.86,22.99 | R25.2 40.39,7.15 R17.2 38.61,5.84 | 38.61,5.84 38.61,5.59 U$2.3V | TM1.1 35.78,5.84 38.61,5.84 | PAPER_OUT.3 49.53,15.37 49.53,20.32 46.99,22.86
  Top 0.508: SCANNER1.4 46.14,36.54 R19.2 R21.2 44.03,40.22 43.18,39.37 41.12,39.37 U2.3
  Bottom 0.254: v4.57,2.79 4.57,10.16 4.57,16.38 4.45,16.51 v4.32,16.51
  Bottom 0.406: SPOIL_BTN1.2 57.21,36.77 57.28,36.83 | 57.28,36.83 58.42,36.83 | 58.42,36.83 PMOD2.12 | 57.28,36.83 57.28,39.37 | 58.42,36.83 58.42,30.48 58.42,25.27 CAST_BTN1.2
  Bottom 0.508: 4.57,10.16 27.94,10.16 U$2.3V 38.1,5.08 59.69,5.08 60.96,6.35 | PMOD1.12 PMOD1.11 60.96,6.35 | PAPER_OUT.3 48.26,12.7 50.8,10.16 LCD.2 57.28,10.16 61.02,6.41 61.09,6.48 60.96,6.35 | PMOD2.11 PMOD2.12 63.44,36.77 57.21,36.77 | PAPER_IN.3 CAST_BTN1.2 58.42,25.27 58.42,30.48 | 58.42,30.48 58.42,36.83 | CAST_BTN1.4 56.01,28.07 58.42,30.48 | 57.21,36.77 SPOIL_BTN1.2 SCANNER1.4 | 57.21,36.77 57.28,36.83 | SPOIL_BTN1.4 57.28,39.37 57.28,36.83 | 57.28,36.83 57.21,36.77
+12V
  Top 0.254: IC4.5 7.8,40.81 C6.+
  Top 0.762: C7.1 8.11,47.99 J1.P1
  Top 0.813: IC4.5 6.39,40.81 | 8.01,43.69 8.01,43.18 C6.+ 8.01,45.24 C7.1
CUTOUT
  cutout Route2: -2.54,31.75 11.43,31.75 15.24,35.56 15.24,53.34 15.24,35.56 11.43,31.75
  cutout Route15: -3.81,31.75 11.43,31.75 15.24,35.56 15.24,53.34 15.24,35.56 11.43,31.75
GND  (via drill 0.35)
  Top 0.254: IC4.1 1.91,32.38 6.35,27.94 C1.2
  other vias: 3.81,38.1 2.54,39.37 5.08,39.37 7.62,39.37 6.35,38.1 7.62,36.83 5.08,36.83 2.54,36.83 5.97,33.02 7.37,33.02 8.76,33.02 10.16,33.02 11.3,33.66 12.19,34.54 13.21,35.43 13.84,36.45 14.1,37.85 14.1,39.37 14.1,42.8 14.1,44.07 3.17,42.42 3.17,43.69 3.17,45.21 14.1,45.59 14.1,46.99 7.24,49.4 3.17,46.74 14.1,48.64 14.1,50.04 14.1,51.56 28.96,33.36 29.97,39.62 18.54,45.97 18.54,40.89 22.35,44.7 21.08,25.65 19.81,18.03 31.24,18.03 31.24,24.38
  pour Top: 1.4,39.75 0,39.75 0,36.32 9.14,36.32 9.14,39.75
  pour Bottom: 0,39.37 0,36.83 0,36.32 9.14,36.32 9.14,39.75 0,39.75
  pour Bottom: -1.27,54.61 -1.27,-1.27 68.58,-1.27 68.58,54.61 67.31,55.88 0,55.88
  pour Top: -1.27,57.15 -1.27,-1.27 67.31,-1.27 69.85,1.27 69.85,54.61 67.31,57.15
  pour Route2: -2.54,55.88 -2.54,-1.27 0,-3.81 66.04,-3.81 72.39,2.54 72.39,53.34 69.85,55.88
  pour Route15: -6.35,57.15 -6.35,3.81 -1.27,-1.27 69.85,-1.27 71.12,0 71.12,53.34 68.58,55.88 -5.08,55.88
GPIO1.0
  Top 0.254: SPOIL_BTN1.1 59.45,36.72 C12.1 59.48,38 R23.2
  Route15 0.254: PMOD2.1 64.77,25.4 64.77,29.91 64.54,30.13 64.54,32.18 63.7,33.02 55.88,33.02 | 55.88,33.02 SPOIL_BTN1.1 | 55.88,33.02 56.52,33.02 57.53,34.04 57.53,44.07 U$2.D5
GPIO1.1  (via drill 0.35)
  Top 0.254: T3.3 58.28,43.46 | 58.28,43.46 R13.2 60.96,41.06 63.7,41.06 67.4,37.36 67.4,27.94 66.13,26.67 PMOD2.3 | v58.42,41.91 58.42,43.32 58.28,43.46
  Route15 0.254: U$2.D4 53.34,49.53 58.17,44.7 58.17,42.16 v58.42,41.91
GPIO1.2
  Top 0.254: C9.1 61.3,25.93 | 61.3,25.93 R22.2 61.56,27.94 64.77,27.94 PMOD2.5 | CAST_BTN1.1 58.29,22.86 58.42,22.86 61.3,25.74 61.3,25.93
  Route15 0.254: U$2.D3 55.88,48.26 64.95,39.19 64.95,30.3 PMOD2.5
GPIO1.3  (via drill 0.35)
  Top 0.254: v44.03,27.6 R15.2 39.89,27.6 T4.3 | PMOD2.7 66.04,32 65.02,33.02 62.61,33.02 61.34,31.75 52.07,31.75 51.18,30.86 v51.18,30.35
  Route15 0.254: U$2.D2 58.42,48.26 58.42,46.99 64.86,40.55 64.86,39.9 67.31,37.45 67.31,33.02 PMOD2.7
  Bottom 0.254: v51.18,30.35 51.18,27.81 49.91,26.54 44.7,26.54 44.03,27.22 v44.03,27.6
GPIO2.0  (via drill 0.35)
  Top 0.254: IC4.2 3.17,32.57 8.19,27.56 17.78,27.56 v18.16,27.18 | PMOD2.6 62.74,29.97 55.88,29.97 | 55.88,29.97 55.44,29.97 | 55.88,29.97 54.48,29.97 v53.21,28.7 52.83,28.32 50.29,28.32 49.4,29.21 49.4,31.62 50.8,33.02 51.18,33.4 51.18,46.86 49.02,49.02 47.75,49.02 45.97,50.8 U$2.D7
  Bottom 0.254: v18.16,27.18 18.8,27.81 41.02,27.81 42.67,26.16 43.94,26.16 44.37,25.73 50.25,25.73 51.99,27.48 v53.21,28.7
GPIO2.1  (via drill 0.35)
  Top 0.254: IC4.3 4.45,32.77 9.08,28.13 16.45,28.13 v16.76,28.45 | PMOD2.8 62.48,30.73 53.59,30.73 v52.07,29.21 51.94,29.08 50.55,29.08 50.04,29.59 50.04,30.99 52.07,33.02 52.07,46.99 U$2.D6
  Bottom 0.254: v16.76,28.45 41.4,28.45 43.18,26.67 44,26.67 44.54,26.14 50.08,26.14 51.59,27.64 51.59,28.73 v52.07,29.21
GPIOX.0  (via drill 0.35)
  Top 0.254: C4.1 36.44,12.45 | 36.44,12.45 37.26,13.28 IC2.1 | R17.1 38.61,10.16 | 38.61,10.16 38.61,10.67 36.82,12.45 36.44,12.45 | 38.61,10.16 39.37,10.16 v39.5,10.29
  Route15 0.254: v39.5,10.29 41.02,10.29 45.47,5.84 45.47,5.25 49.53,1.18 57.06,1.18 U$2.A3 60.96,5.08 66.91,5.08 67.31,5.48 67.31,11.43 | 67.31,10.79 67.31,11.43 | 67.31,11.43 67.31,12.19 66.67,12.83 65.41,12.83 64.26,13.97 PMOD1.5
GPIOX.1  (via drill 0.35)
  Top 0.254: C5.1 36.82,20.32 38.19,20.32 R16.1 38.99,20.87 IC2.7 38.99,16.89 39.62,16.26 42.93,16.26 v43.18,16.51
  Route15 0.254: v43.18,16.51 47.37,16.51 52.45,11.43 59.69,11.43 | 59.69,11.43 60.96,11.43 PMOD1.7 | U$2.A2 59.69,6.35 59.69,11.43
MISO  (via drill 0.35)
  Top 0.254: U1.7 8.89,20.71 v8.89,21.59 R4.1
  Route15 0.254: U$2.D12 33.53,48.77 40.64,48.77 51.71,37.69 51.71,31.46 53.17,30 59.28,30 60.6,28.68 60.6,16.87 62.23,15.24 65.41,15.24 66.04,14.61 PMOD1.6
  Bottom 0.254: U$2.D12 31.5,48.39 13.55,30.44 13.55,23.71 11.43,21.59 v8.89,21.59
MOSI  (via drill 0.35)
  Top 0.254: U1.3 8.69,16.31 v12.7,20.32 13.97,21.59 R5.1
  Route15 0.254: U$2.D11 35.43,49.4 38.48,49.4 38.52,49.36 40.62,49.36 52.12,37.86 52.12,31.63 53.34,30.4 59.76,30.4 61.01,29.15 61.01,21.41 61.59,20.83 64.64,20.83 64.77,20.7 64.77,17.53 65.79,16.51 PMOD1.4
  Bottom 0.254: U$2.D11 34.04,50.29 14.48,30.73 14.48,23.11 12.7,21.34 v12.7,20.32
N$1
  Top 0.254: IC2.5 41.53,20.99 R24.1 39.67,21.63 39.53,21.77 35.91,21.77 TM2.2
N$2
  Top 0.254: IC2.3 40.26,11.3 40.77,10.79 R25.1 40.3,8 37.59,8 35.69,9.91 TM1.2
N$3
  Top 0.254: IC1.1 9.78,1.65 Q2.2
N$8
  Top 0.254: IC1.2 8.51,2.92 Q2.1
N$9
  Top 0.254: IC1.3 8,4.19 9.65,5.84 12.57,5.84 14.35,4.06 20.45,4.06 23.75,7.37 23.75,7.49 24,7.49 BATT1.P1
N$10
  Top 0.254: R12.1 53.99,45.3 T3.1
N$12
  Top 0.508: R11.2 R10.1 35.79,38.29 U2.1
N$13
  Top 0.254: 38.86,13.15 IC2.2 38.99,14.86 39.37,15.24 44.45,15.24 45.09,14.61 45.09,12.19 PAPER_OUT.2
N$14
  Top 0.254: SPOIL_BTN1.3 53.34,40.51 R12.2
N$15
  Top 0.254: IC2.6 40.26,17.02 40.39,16.89 42.16,16.89 43.94,18.67 43.94,19.68 44.58,20.32 PAPER_IN.2
N$22
  Top 0.813: IC4.8 1.91,48.64 MOTOR1.1
N$26
  Top 0.254: T4.1 36.82,28.42 R14.1
N$28
  Top 0.813: IC4.6 4.57,40.94 | 4.57,47.5 4.57,40.94 | MOTOR1.2 5.21,48.13 4.57,47.5 | 4.57,47.5 4.57,40.94
N$29
  Top 0.508: IC4.4 7.2,35.39 R18.2
N$30
  Top 0.254: R14.2 37.38,26.16 40.77,26.16 42.04,24.89 55.24,24.89 CAST_BTN1.3
SCAN_DIN
  Top 0.254: R21.1 43.2,41.52 T6.1 39.62,42.16 39.24,41.78 39.24,38.73 39.75,38.23 41.66,38.23 SCANNER1.3 46.99,33.02
  Bottom 0.254: SCANNER1.3 45.09,34.8 45.09,35.62 60.27,50.8 U$2.D1
SCAN_DOUT  (via drill 0.35)
  Top 0.254: T5.1 47.02,41.47 R19.1 47.84,38.14 v48.51,37.47 | v59.94,49.28 58.17,49.28 v54.61,49.28
  Route15 0.254: SCANNER1.2 48.51,31.88 v48.51,37.47
  Bottom 0.254: U$2.D0 62.48,49.78 62.1,49.78 61.59,49.28 v59.94,49.28 | v54.61,49.28 54.61,45.72 44.45,35.56 44.45,31.75 45.72,30.48 SCANNER1.2
SCK  (via drill 0.35)
  Top 0.254: U1.5 8.86,18.51 11.43,21.08 11.43,22.86 | 11.43,22.86 R2.1 | v12.7,23.88 12.45,23.88 11.43,22.86
  Route15 0.254: U$2.D13 31.5,48.26 40.51,48.26 51.31,37.47 51.31,31.29 53.01,29.59 58.8,29.59 60.2,28.19 60.2,13.84 61.34,12.7 64.77,12.7 PMOD1.8
  Bottom 0.254: U$2.D13 28.96,46.61 27.11,44.77 12.7,30.35 v12.7,23.88
SCL0  (via drill 0.35)
  Top 0.254: U$2.A5 60.71,5.33 60.71,13.84 61.28,14.41 | 61.28,14.41 63.37,16.51 PMOD1.3 | LCD.4 60.45,15.24 61.28,14.41 | R3.1 51.82,13.25 52.07,13.25 52.49,13.25 53.21,13.97 v53.34,13.97 | IC1.6 2.19,4.12 2.55,4.12 7.28,8.85 | 7.28,8.85 7.45,9.02 | 7.28,8.85 9.48,11.05 v9.65,11.05
  Bottom 0.254: LCD.4 54.74,13.97 v53.34,13.97 52.93,14.38 12.98,14.38 v9.65,11.05
SDA0  (via drill 0.35)
  Top 0.254: U$2.A4 60.07,3.43 60.07,12.45 59.82,12.7 LCD.3 54.36,14.1 54.36,16.51 | PMOD1.1 60.96,16.51 54.36,16.51 | R1.1 53,17.87 54.36,16.51 | v12.7,12.7 9.36,12.7 IC1.5
  Bottom 0.254: v12.7,12.7 13.97,13.97 52.07,13.97 53.34,12.7 LCD.3
SS  (via drill 0.35)
  Top 0.254: U1.2 9.12,15.21 15.11,21.21 15.11,22.35 16.51,23.75 R7.1 16.99,24.07 v17.72,24.07
  Route15 0.254: PMOD1.2 66.04,21.34 65.66,21.72 62.48,21.72 61.42,22.78 61.42,29.57 60.18,30.81 53.51,30.81 52.53,31.79 52.53,38.03 40.79,49.77 38.69,49.77 38.65,49.81 37.57,49.81 U$2.D10
  Bottom 0.254: v17.72,24.07 17.72,25.59 15.37,27.94 15.37,30.86 32.77,48.26 34.04,48.26 U$2.D10
UART1_RX  (via drill 0.35)
  Top 0.254: 41.91,46.14 R20.1 | R20.1 42.24,45.63 T6.2 42.42,44.2 | R20.1 42.33,46.48 44.23,48.39 47.75,48.39 49.66,46.48 v49.66,43.94
  Route15 0.254: PMOD2.4 62.36,27.81 62.36,29.97 60.71,31.62 53.85,31.62 53.34,32.13 53.34,40.26 50.61,42.99 | 50.61,42.99 v49.66,43.94 50.61,42.99
UART1_TX  (via drill 0.35)
  Top 0.254: 46.14,46.01 R6.1 46.05,45.63 T5.2 46.94,43.31 49.02,43.31 v49.02,43.18
  Route15 0.254: PMOD2.2 63.37,24.13 61.95,25.55 61.95,29.62 60.35,31.22 53.68,31.22 52.93,31.96 52.93,39.27 v49.02,43.18

### Text on the board
tPlace: - | +
tNames: Smart Ballot Box Shield v0